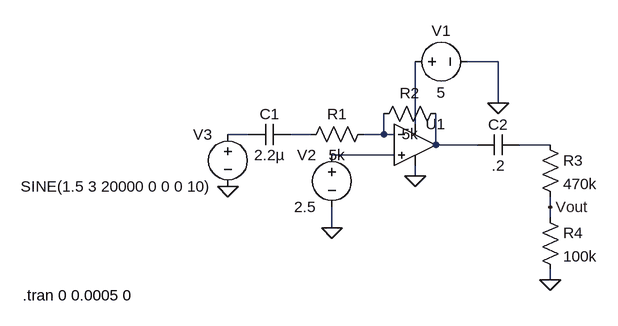
[diagram p0: schematic InterfaceBoard.asc]
InterfaceBoard.asc, the LTspice schematic file:
Version 4
SHEET 1 880 680
WIRE 368 32 320 32
WIRE 368 96 368 32
WIRE 240 128 240 32
WIRE -16 144 -48 144
WIRE 80 144 48 144
WIRE 192 144 192 112
WIRE 192 144 160 144
WIRE 208 144 192 144
WIRE 272 160 272 112
WIRE 336 160 272 160
WIRE 448 160 400 160
WIRE 208 176 112 176
WIRE 240 208 240 192
WIRE 448 256 448 240
WIRE 448 272 448 256
WIRE 112 288 112 256
WIRE 448 368 448 352
FLAG 112 288 0
FLAG 240 208 0
FLAG 368 96 0
FLAG -48 224 0
FLAG 448 368 0
FLAG 448 256 Vout
SYMBOL voltage 224 32 R270
WINDOW 0 32 56 VTop 2
WINDOW 3 -32 56 VBottom 2
WINDOW 123 0 0 Left 2
WINDOW 39 0 0 Left 2
SYMATTR InstName V1
SYMATTR Value 5
SYMBOL voltage 112 160 M0
WINDOW 123 0 0 Left 2
WINDOW 39 0 0 Left 2
SYMATTR InstName V2
SYMATTR Value 2.5
SYMBOL voltage -48 128 M0
WINDOW 123 0 0 Left 2
WINDOW 39 0 0 Left 2
SYMATTR InstName V3
SYMATTR Value SINE(1.5 3 20000 0 0 0 10)
SYMBOL cap -16 160 R270
WINDOW 0 32 32 VTop 2
WINDOW 3 0 32 VBottom 2
SYMATTR InstName C1
SYMATTR Value 2.2µ
SYMBOL res 64 160 R270
WINDOW 0 32 56 VTop 2
WINDOW 3 0 56 VBottom 2
SYMATTR InstName R1
SYMATTR Value 5k
SYMBOL res 176 128 R270
WINDOW 0 32 56 VTop 2
WINDOW 3 0 56 VBottom 2
SYMATTR InstName R2
SYMATTR Value 5k
SYMBOL res 432 144 R0
SYMATTR InstName R3
SYMATTR Value 470k
SYMBOL res 432 256 R0
SYMATTR InstName R4
SYMATTR Value 100k
SYMBOL cap 336 176 R270
WINDOW 0 32 32 VTop 2
WINDOW 3 0 32 VBottom 2
SYMATTR InstName C2
SYMATTR Value .2
SYMBOL Opamps\\UniversalOpamp2 240 160 R0
SYMATTR InstName U1
TEXT -364 392 Left 2 !.tran 0 0.0005 0

The netlist it stands for:
* InterfaceBoard.asc
V1 N001 0 5
V2 N007 0 2.5
V3 N002 0 SINE(1.5 3 20000 0 0 0 10)
C1 N002 N003 2.2µ
R1 N003 N004 5k
R2 N004 N005 5k
R3 N006 Vout 470k
R4 Vout 0 100k
C2 N005 N006 .2
XU1 N007 N004 N001 0 N005 level.2 Avol=1Meg GBW=10Meg Slew=10Meg ilimit=25m rail=0 Vos=0 phimargin=45 en=0 enk=0 in=0 ink=0 Rin=500Meg  ; pins IN+ IN- V+ V- OUT
.tran 0 0.0005 0
.lib UniversalOpamps2.sub
.backanno
.end